# Altium schematic sheet bidirectional_audio_v4.0_AFE.SchDoc
size B; PageSetup: Record=PageOptions|CenterHorizontal=True|CenterVertical=True|PrintScale=0.70|XCorrection=0.00|YCorrection=1.00|PrintKind=2|BorderSize=5000000|LeftOffset=0|BottomOffset=0|Orientation=2|PaperLength=1000|PaperWidth=1000|Scale=100|PaperSource=15|PrintQuality=1200|MediaType=1|DitherType=10|PaperKind=Letter|PrintScaleMode=1
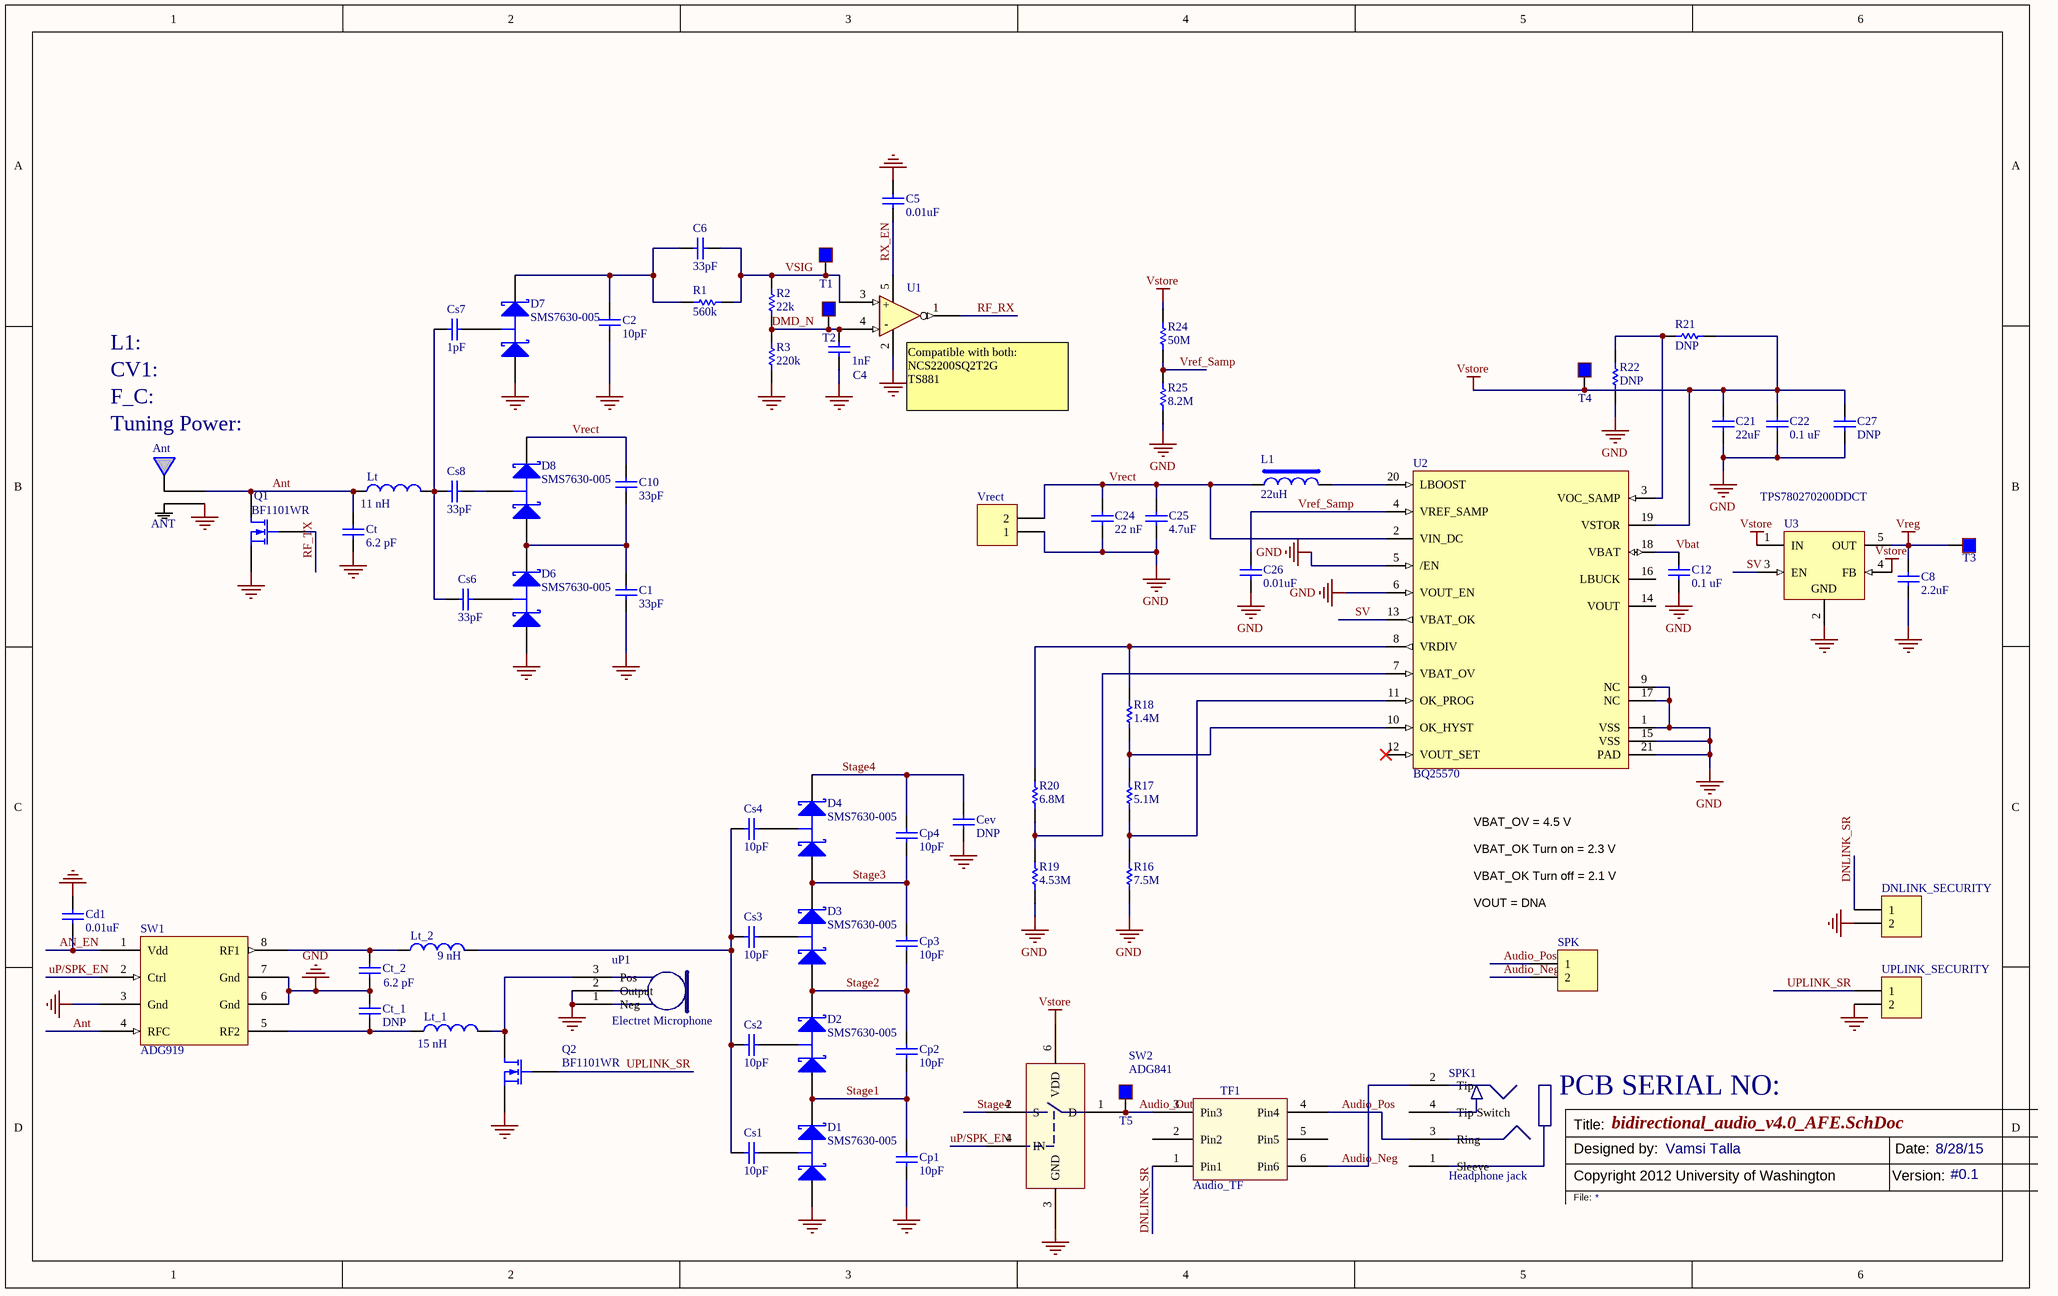
[diagram p0: bidirectional_audio_v4.0_AFE.SchDoc]

## Parts
Ant  ANT  [PIFA_915MHz]  (net tie, no BOM)
C1  value 33pF  [0402]  (hidden comment: Cp_rect)
C2  value 10pF  [0402]  (hidden comment: Cdemod_1)
C4  value 1nF  [0402]  (hidden comment: Cdemod_2)
C5  value 0.01uF  [0402]  (hidden comment: Cdecap_MSP)
C6  value 33pF  [0402]  (hidden comment: Cdemod_3)
C8  value 2.2uF  [0402]  (hidden comment: Cout_LDO)
C10  value 33pF  [0402]  (hidden comment: Cp_rect)
C12  value 0.1 uF  [0402]  (hidden comment: Cstore)
C21  value 22uF  [0805-W]  (hidden comment: Cstore)
C22  value 0.1 uF  [0402]  (hidden comment: Cstore)
C24  value 22 nF  [0402]  (hidden comment: Cin_boost1)
C25  value 4.7uF  [0402]  (hidden comment: Cin_boost2)
C26  value 0.01uF  [0402]  (hidden comment: Cref)
C27  value DNP  [0805-W]  (hidden comment: Cstore2)
Cd1  value 0.01uF  [0402]  (hidden comment: Cdecap_MSP)
Cev  value DNP  [0402]  (hidden comment: Cout_env)
Cp1  value 10pF  [0402]  (hidden comment: Cp_env)
Cp2  value 10pF  [0402]  (hidden comment: Cp_env)
Cp3  value 10pF  [0402]  (hidden comment: Cp_env)
Cp4  value 10pF  [0402]  (hidden comment: Cp_env)
Cs1  value 10pF  [0402]  (hidden comment: Cs_env)
Cs2  value 10pF  [0402]  (hidden comment: Cs_env)
Cs3  value 10pF  [0402]  (hidden comment: Cs_env)
Cs4  value 10pF  [0402]  (hidden comment: Cs_env)
Cs6  value 33pF  [0402]  (hidden comment: Cs_rect)
Cs7  value 1pF  [0402]  (hidden comment: Cs_rx)
Cs8  value 33pF  [0402]  (hidden comment: Cs_rect)
Ct  value 6.2 pF  [0402]  (hidden comment: C_Ant_tune)
Ct_1  value DNP  [0402]  (hidden comment: Cap)
Ct_2  value 6.2 pF  [0402]  (hidden comment: Cap)
D1  SMS7630-005  [SOT23 - N]
D2  SMS7630-005  [SOT23 - N]
D3  SMS7630-005  [SOT23 - N]
D4  SMS7630-005  [SOT23 - N]
D6  SMS7630-005  [SOT23 - N]
D7  SMS7630-005  [SOT23 - N]
D8  SMS7630-005  [SOT23 - N]
DNLINK_SECURITY  MHDR1X2  [MHDR1X2]  (value not drawn)
L1  value 22uH  [LPS4018]  (hidden comment: Ind_LPS4018)
Lt  value 11 nH  [0402]  (hidden comment: L_Ant_tune)
Lt_1  value 15 nH  [0402]  (hidden comment: Ind)
Lt_2  value 9 nH  [0402]  (hidden comment: Ind)
Q1  BF1101WR  [SOT343R]
Q2  BF1101WR  [SOT343R]
R1  value 560k  [0402]  (hidden comment: Res_demod1)
R2  value 22k  [0402]  (hidden comment: Res_demod2)
R3  value 220k  [0402]  (hidden comment: Res_demod3)
R16  value 7.5M  [0402]  (hidden comment: Rok1)
R17  value 5.1M  [0402]  (hidden comment: Rok2)
R18  value 1.4M  [0402]  (hidden comment: Rok3)
R19  value 4.53M  [0402]  (hidden comment: Rov1)
R20  value 6.8M  [0402]  (hidden comment: Rov2)
R21  value DNP  [0402]  (hidden comment: R_80%)
R22  value DNP  [0402]  (hidden comment: R_50%)
R24  value 50M  [0402]  (hidden comment: Res_MPPTfixed)
R25  value 8.2M  [0402]  (hidden comment: Res_MPPTfixed)
SPK  MHDR1X2  [MHDR1X2]  (value not drawn)
SPK1  Headphone jack  [CONN_JACK]
SW1  ADG919  [MSOP_8pin]
SW2  ADG841  [SC70-6]
T1  Test Point SMT  [SMT_TESTPOINT_2MM]  (value not drawn)
T2  Test Point SMT  [SMT_TESTPOINT_2MM]  (value not drawn)
T3  Test Point SMT  [SMT_TESTPOINT_2MM]  (value not drawn)
T4  Test Point SMT  [SMT_TESTPOINT_2MM]  (value not drawn)
T5  Test Point SMT  [SMT_TESTPOINT_2MM]  (value not drawn)
TF1  Audio_TF  [Audio_TF]
U1  Comparator  [SC70-5]  (value not drawn)
U2  BQ25570  [BQ25570]
U3  TPS780270200DDCT  [TI-DDC5_L]
uP1  Electret Microphone  [uP_23024]
UPLINK_SECURITY  MHDR1X2  [MHDR1X2]  (value not drawn)
Vrect  MHDR1X2  [MHDR1X2]  (value not drawn)

## Nets
GND: Ant.2(Gnd) C1.1 C2.1 C4.2 C5.2 C8.1 C12.1 C21.1 C22.1 C24.1 C25.1 C26.1 C27.1 Cd1.2 Cev.2 Cp1.1 Ct.2 Ct_1.1 Ct_2.2 D1.1(A) D6.1(A) D7.1(A) DNLINK_SECURITY.2 Q1.1(S) Q2.1(S) R3.1 R16.2 R19.2 R22.1 R25.1 SW1.3(Gnd) SW1.6(Gnd) SW1.7(Gnd) SW2.3(GND) U1.2(Gnd) U2.1(VSS) U2.5(/EN) U2.6(VOUT_EN) U2.9(NC) U2.15(VSS) U2.17(NC) U2.21(PAD) U3.2(GND) uP1.1(Neg) uP1.2(Output) UPLINK_SECURITY.2 Vrect.1
Vreg: C8.2 T3.1 U3.5(OUT)
Vstore: C21.2 C22.2 C27.2 R21.2 R24.2 SW2.6(VDD) T4.1 U2.19(VSTOR) U3.1(IN) U3.4(FB)
AN_EN: Cd1.1 SW1.1(Vdd)
Ant: Ant.1(Feed) Ct.1 Lt.1 Q1.2(D) SW1.4(RFC)
Audio_Neg: SPK.2 SPK1.2(Tip) TF1.6(Pin6)
Audio_Out: SW2.1(D) T5.1 TF1.3(Pin3)
Audio_Pos: SPK.1 SPK1.3(Ring) TF1.4(Pin4)
DMD_N: C4.1 R2.1 R3.2 T2.1 U1.4(In-)
DNLINK_SR: DNLINK_SECURITY.1 TF1.1(Pin1)
RF_RX: U1.1(OUT)
RF_TX: Q1.3(G)
RX_EN: C5.1 U1.5(VDD)
Stage1: Cp1.2 Cp2.1 D1.2(K) D2.1(A)
Stage2: Cp2.2 Cp3.1 D2.2(K) D3.1(A)
Stage3: Cp3.2 Cp4.1 D3.2(K) D4.1(A)
Stage4: Cev.1 Cp4.2 D4.2(K) SW2.2(S)
SV: U2.13(VBAT_OK) U3.3(EN)
uP/SPK_EN: SW1.2(Ctrl) SW2.4(IN)
UPLINK_SR: Q2.3(G) UPLINK_SECURITY.1
Vbat: C12.2 U2.18(VBAT)
Vrect: C10.2 C24.2 C25.2 D8.2(K) L1.1 U2.2(VIN_DC) Vrect.2
Vref_Samp: C26.2 R24.1 R25.2 U2.4(VREF_SAMP)
VSIG: C6.2 R1.1 R2.2 T1.1 U1.3(IN+)
NetC1_2: C1.2 C10.1 D6.2(K) D8.1(A)
NetC2_2: C2.2 C6.1 D7.2(K) R1.2
NetCs1_1: Cs1.1 Cs2.1 Cs3.1 Cs4.1 Lt_2.2
NetCs1_2: Cs1.2 D1.3(C)
NetCs2_2: Cs2.2 D2.3(C)
NetCs3_2: Cs3.2 D3.3(C)
NetCs4_2: Cs4.2 D4.3(C)
NetCs6_1: Cs6.1 Cs7.1 Cs8.1 Lt.2
NetCs6_2: Cs6.2 D6.3(C)
NetCs7_2: Cs7.2 D7.3(C)
NetCs8_2: Cs8.2 D8.3(C)
NetCt_1_2: Ct_1.2 Lt_1.1 SW1.5(RF2)
NetCt_2_1: Ct_2.1 Lt_2.1 SW1.8(RF1)
NetL1_2: L1.2 U2.20(LBOOST)
NetLt_1_2: Lt_1.2 Q2.2(D) uP1.3(Pos)
NetR16_1: R16.1 R17.2 U2.11(OK_PROG)
NetR17_1: R17.1 R18.2 U2.10(OK_HYST)
NetR18_1: R18.1 R20.1 U2.8(VRDIV)
NetR19_1: R19.1 R20.2 U2.7(VBAT_OV)
NetR21_1: R21.1 R22.2 U2.3(VOC_SAMP)

Not connected (* = marked no-connect by the designer): SPK1 1(Sleeve) 4(Tip_Switch); TF1 2(Pin2) 5(Pin5); U2 12(VOUT_SET)* 14(VOUT) 16(LBUCK)

## Notes on the sheet
- L1:
- CV1:
- F_C:
- Tuning Power:
- (near U1) Compatible with both:
  NCS2200SQ2T2G
  TS881
- VBAT_OV = 4.5 V
- VBAT_OK Turn on = 2.3 V
- VBAT_OK Turn off = 2.1 V
- VOUT = DNA
- PCB SERIAL NO:
- Title:
- Copyright 2012 University of Washington
- Designed by:
- Vamsi Talla
- Version:
- Date:
- 8/28/15
- #0.1
- File:
- (in symbol NCS2200) +; -

## Library data of the parts
C1 C6 C10 Cs6 Cs8 = Cap: Ceramic Capacitor (Surface Mount); Manufacturer: Johanson Technology Inc.; Manufacturer Part Number: 500R07S330GV4T; Note: CAP CER 33PF 50V NP0 0402; Rating: 50 V; Digi-Key Part Number: 712-1297-1-ND
C2 Cp1-Cp4 Cs1-Cs4 = Cap: Ceramic Capacitor (Surface Mount); Manufacturer: Johanson Technology Inc.; Manufacturer Part Number: 500R07S100GV4T; Note: CAP CER 10PF 50V NP0 0402; Rating: 50 V; Digi-Key Part Number: 712-1252-1-ND
C4 = Cap: Ceramic Capacitor (Surface Mount); Manufacturer: Murata Electronics North America; Manufacturer Part Number: GRM1555C1H102FA01D; Note: CAP CER 1000PF 50V NP0 0402; Rating: 50 V; Digi-Key Part Number: 490-6189-1-ND
C5 C26 Cd1 = Cap: Ceramic Capacitor (Surface Mount); Manufacturer: Samsung Electro-Mechanics America, Inc.; Manufacturer Part Number: CL05B103JB5NNNC; Note: CAP CER 10000PF 50V X7R 0402; Digi-Key Part Number: 1276-1495-1-ND; Rating: *
C8 = Cap: Ceramic Capacitor (Surface Mount); Manufacturer: AVX Corporation; Manufacturer Part Number: 04026D225KAT2A; Note: CAP CER 2.2UF 6.3V X5R 0402; Rating: 6.3 V; Digi-Key Part Number: 478-7885-1-ND
C12 C22 = Cap: Ceramic Capacitor (Surface Mount); Manufacturer: Murata Electronics North America; Manufacturer Part Number: GRM155R71C104JA88D; Note: CAP CER 0.1UF 16V X7R 0402; Rating: 16 V; Digi-Key Part Number: 490-6327-1-ND
C21 = Cap: Ceramic Capacitor (Surface Mount); Manufacturer: Samsung Electro-Mechanics America, Inc.; Manufacturer Part Number: CL10A226KQ8NRNE; Note: CAP CER 22UF 6.3V X5R 0603; Rating: 6.3V; Digi-Key Part Number: 1276-2867-1-ND
C24 = Cap: Ceramic Capacitor (Surface Mount); Manufacturer: AVX Corporation; Manufacturer Part Number: 0402YC223JAT2A; Note: CAP CER 0.022UF 16V X7R 0402; Rating: 16 V; Digi-Key Part Number: 478-3666-1-ND
C25 = Cap: Ceramic Capacitor (Surface Mount); Manufacturer: TDK Corporation; Manufacturer Part Number: C1005X5R0J475K050BC; Note: CAP CER 4.7UF 6.3V X5R 0402; Rating: 6.3 V; Digi-Key Part Number: 445-5947-1-ND
C27 Cev Ct_1 = Cap: Ceramic Capacitor (Surface Mount); Manufacturer: Generic Ceramic Chip Cap (TBD); Digi-Key Part Number: *; Manufacturer Part Number: *; Note: *; Rating: *
Cs7 = Cap: Ceramic Capacitor (Surface Mount); Manufacturer: Johanson Technology Inc.; Manufacturer Part Number: 500R07S1R0BV4T; Note: CAP CER 1PF 50V NP0 0402; Rating: 50 V; Digi-Key Part Number: 712-1266-1-ND
Ct Ct_2 = Cap: Ceramic Capacitor (Surface Mount); Manufacturer: Johanson Technology Inc.; Manufacturer Part Number: 500R07S6R2CV4T; Digi-Key Part Number: 712-1290-1-ND; Note: *; Rating: *
D1-D4 D6-D8 = SMS7630-005: Agilent Schottky Diode, Two in Series, Small Package SOT-323; Manufacturer: Skyworks Solutions Inc.; Manufacturer Part Number: SMS7630-005LF; Note: *; Digi-Key Part Number: 863-1699-1-ND; Rating: *; Value: *
DNLINK_SECURITY SPK UPLINK_SECURITY Vrect = MHDR1X2: Header, 2-Pin; Manufacturer: FCI; Manufacturer Part Number: 77311-118-02LF; Note: CONN HEADER 2POS VERT T/H; LatestRevisionDate: 17-Jul-2002; LatestRevisionNote: Re-released for DXP Platform.; Publisher: Altium Limited; Digi-Key Part Number: 609-4434-ND
L1 = Ind_LPS4018: Inductor (Surface Mount); Manufacturer: Coil Craft; Manufacturer Part Number: LPS4018-223MLB; Digi-Key Part Number: NA; Rating: *; Note: *
Lt = Ind: Inductor (Surface Mount); Manufacturer Part Number: 0402HP-11NXGE; Digi-Key Part Number: *; Manufacturer: *; Rating: *; Note: *
Lt_1 = Ind: Inductor (Surface Mount); Manufacturer Part Number: 0402HP-15NXGE; Digi-Key Part Number: *; Manufacturer: *; Rating: *; Note: *
Lt_2 = Ind: Inductor (Surface Mount); Manufacturer Part Number: 0402HP-9N0XGE; Digi-Key Part Number: *; Manufacturer: *; Rating: *; Note: *
Q1 Q2 = BF1101WR: N-Channel Dual-Gate Mos-Fets MOSFET, SOT343R; Manufacturer Part Number: BF1101WR,115; Manufacturer: NXP Semiconductors; Digi-Key Part Number: 568-6140-1-ND; Rating: *; Value: *; Note: *
R1 = Res: Chip Resistor (Surface Mount); Manufacturer: Yageo; Manufacturer Part Number: RC0402FR-07560KL; Rating: 1/16W; Note: RES SMD 560K OHM 1% 1/16W 0402; Digi-Key Part Number: 311-560KLRCT-ND
R2 = Res: Chip Resistor (Surface Mount); Manufacturer: Yageo; Manufacturer Part Number: RC0402FR-0722KL; Rating: 1/16W; Digi-Key Part Number: 311-22.0KLRCT-ND
R3 = Res: Chip Resistor (Surface Mount); Manufacturer: Yageo; Manufacturer Part Number: RC0402FR-07220KL; Rating: 1/16W; Digi-Key Part Number: 311-220KLRCT-ND
R16 = Res: Chip Resistor (Surface Mount); Manufacturer: Vishay Dale; Manufacturer Part Number: CRCW04027M50JNED; Rating: 1/16W; Digi-Key Part Number: 541-7.5MJCT-ND; Comment_1: Res
R17 = Res: Chip Resistor (Surface Mount); Manufacturer: Vishay Dale; Manufacturer Part Number: CRCW04025M10JNED; Rating: 1/16W; Digi-Key Part Number: 541-5.1MJCT-ND; Comment_1: Res
R18 = Res: Chip Resistor (Surface Mount); Manufacturer: Vishay Dale; Manufacturer Part Number: CRCW04021M40FKED; Rating: 1/16W; Digi-Key Part Number: 541-1.40MLCT-ND; Comment_1: Res
R19 = Res: Chip Resistor (Surface Mount); Manufacturer: Vishay Dale; Manufacturer Part Number: CRCW04024M53FKED; Rating: 1/16W; Digi-Key Part Number: 541-4.53MLCT-ND; Comment_1: Res
R20 = Res: Chip Resistor (Surface Mount); Manufacturer: Samsung Electro-Mechanics America, Inc.; Manufacturer Part Number: RC1005J685CS; Rating: 1/16W; Digi-Key Part Number: 1276-4467-1-ND; Comment_1: Res
R21 R22 = Res: Chip Resistor (Surface Mount); Manufacturer: Generic Chip Res (TBD); Manufacturer Part Number: *; Digi-Key Part Number: *; Rating: *; Comment_1: Res
R24 = Res: Chip Resistor (Surface Mount); Manufacturer: Stackpole Electronics Inc.; Manufacturer Part Number: HMC0402JT50M0; Rating: 1/16W; Digi-Key Part Number: HMC0402JT50M0CT-ND
R25 = Res: Chip Resistor (Surface Mount); Manufacturer: Vishay Dale; Manufacturer Part Number: CRCW04028M20JNED; Rating: 1/16W; Digi-Key Part Number: 541-8.2MJCT-ND
SPK1 = CONN_JACK: Manufacturer: CUI Inc.; Manufacturer Part Number: SJ-3524-SMT-TR-GR; Note: CONN JACK STEREO 4POS 3.5MM SMD; Digi-Key Part Number: CP-3524SJGRCT-ND
SW1 = ADG919: RF 2:1 MUX/SPDT Reflective; Manufacturer Part Number: ADG919BRMZ; Manufacturer: Analog Devices Inc.; Digi-Key Part Number: ADG919BRMZ-ND; Note: *; Rating: *
SW2 = ADG841: Audio Switch; Manufacturer Part Number: ADG841YKSZ-500RL7; Manufacturer: Analog Devices Inc.; Digi-Key Part Number: ADG841YKSZ-500RL7CT-ND; Value: *; Rating: *; Note: *
T1-T5 = Test Point SMT: Test Point, Flat Pad; Manufacturer Part Number: 1625854-3; Manufacturer: TE Connectivity AMP Connectors; Note: 0603 PROBE PAD; Digi-Key Part Number: A106145CT-ND; Rating: *; Value: *
TF1 = Audio_TF: Audio Transformer by Triad; Manufacturer: Triad Magnetics; Manufacturer Part Number: SP-48; Note: TRANSER 7.5K CT/ 12 OHM AUDIO; Digi-Key Part Number: 237-1146-ND
U1 = NCS2200: 6uA Comparator; Manufacturer: NXP Semiconductors; Manufacturer Part Number: NCX2200GW,125; Note: IC COMPARATOR RRIO SINGLE 5TSSOP; Digi-Key Part Number: 568-7526-1-ND; Rating: *; Value: *
U2 = BQ25570: Boost Charger; Manufacturer: Texas Instruments; Manufacturer Part Number: BQ25570RGRT; Digi-Key Part Number: 296-37014-1-ND; Rating: *; Value: *; Note: *
U3 = CMP-0394-01119-1: Single Output LDO, 150 mA, Adjustable 1.22 to 5.25 V Output, 2.2 to 5.5 V Input, with 500 nA Quiescent Current, 5-pin SOT (DDC), -40 to 125 degC, Green (RoHS & no Sb/Br); Manufacturer: Texas Instruments; PackageReference: DDC5; Manufacturer Part Number: TPS780270200DDCT; PackageVersion: 4204403-2/E; ComponentLink2URL: http://www.ti.com/general/docs/lit/getliterature.tsp?genericPartNumber=TPS78001&fileType=pdf; Note: *; Digi-Key Part Number: 296-32564-1-ND
uP1 = UP_Knowles_23024: Manufacturer Part Number: EK-23024-000; Digi-Key Part Number: 423-1160-ND; Manufacturer: Knowles